# Altium schematic sheet ESP32 with USBC.SchDoc (part 1 of 3)
size A2; SheetNumber: 1; SheetTotal: 1
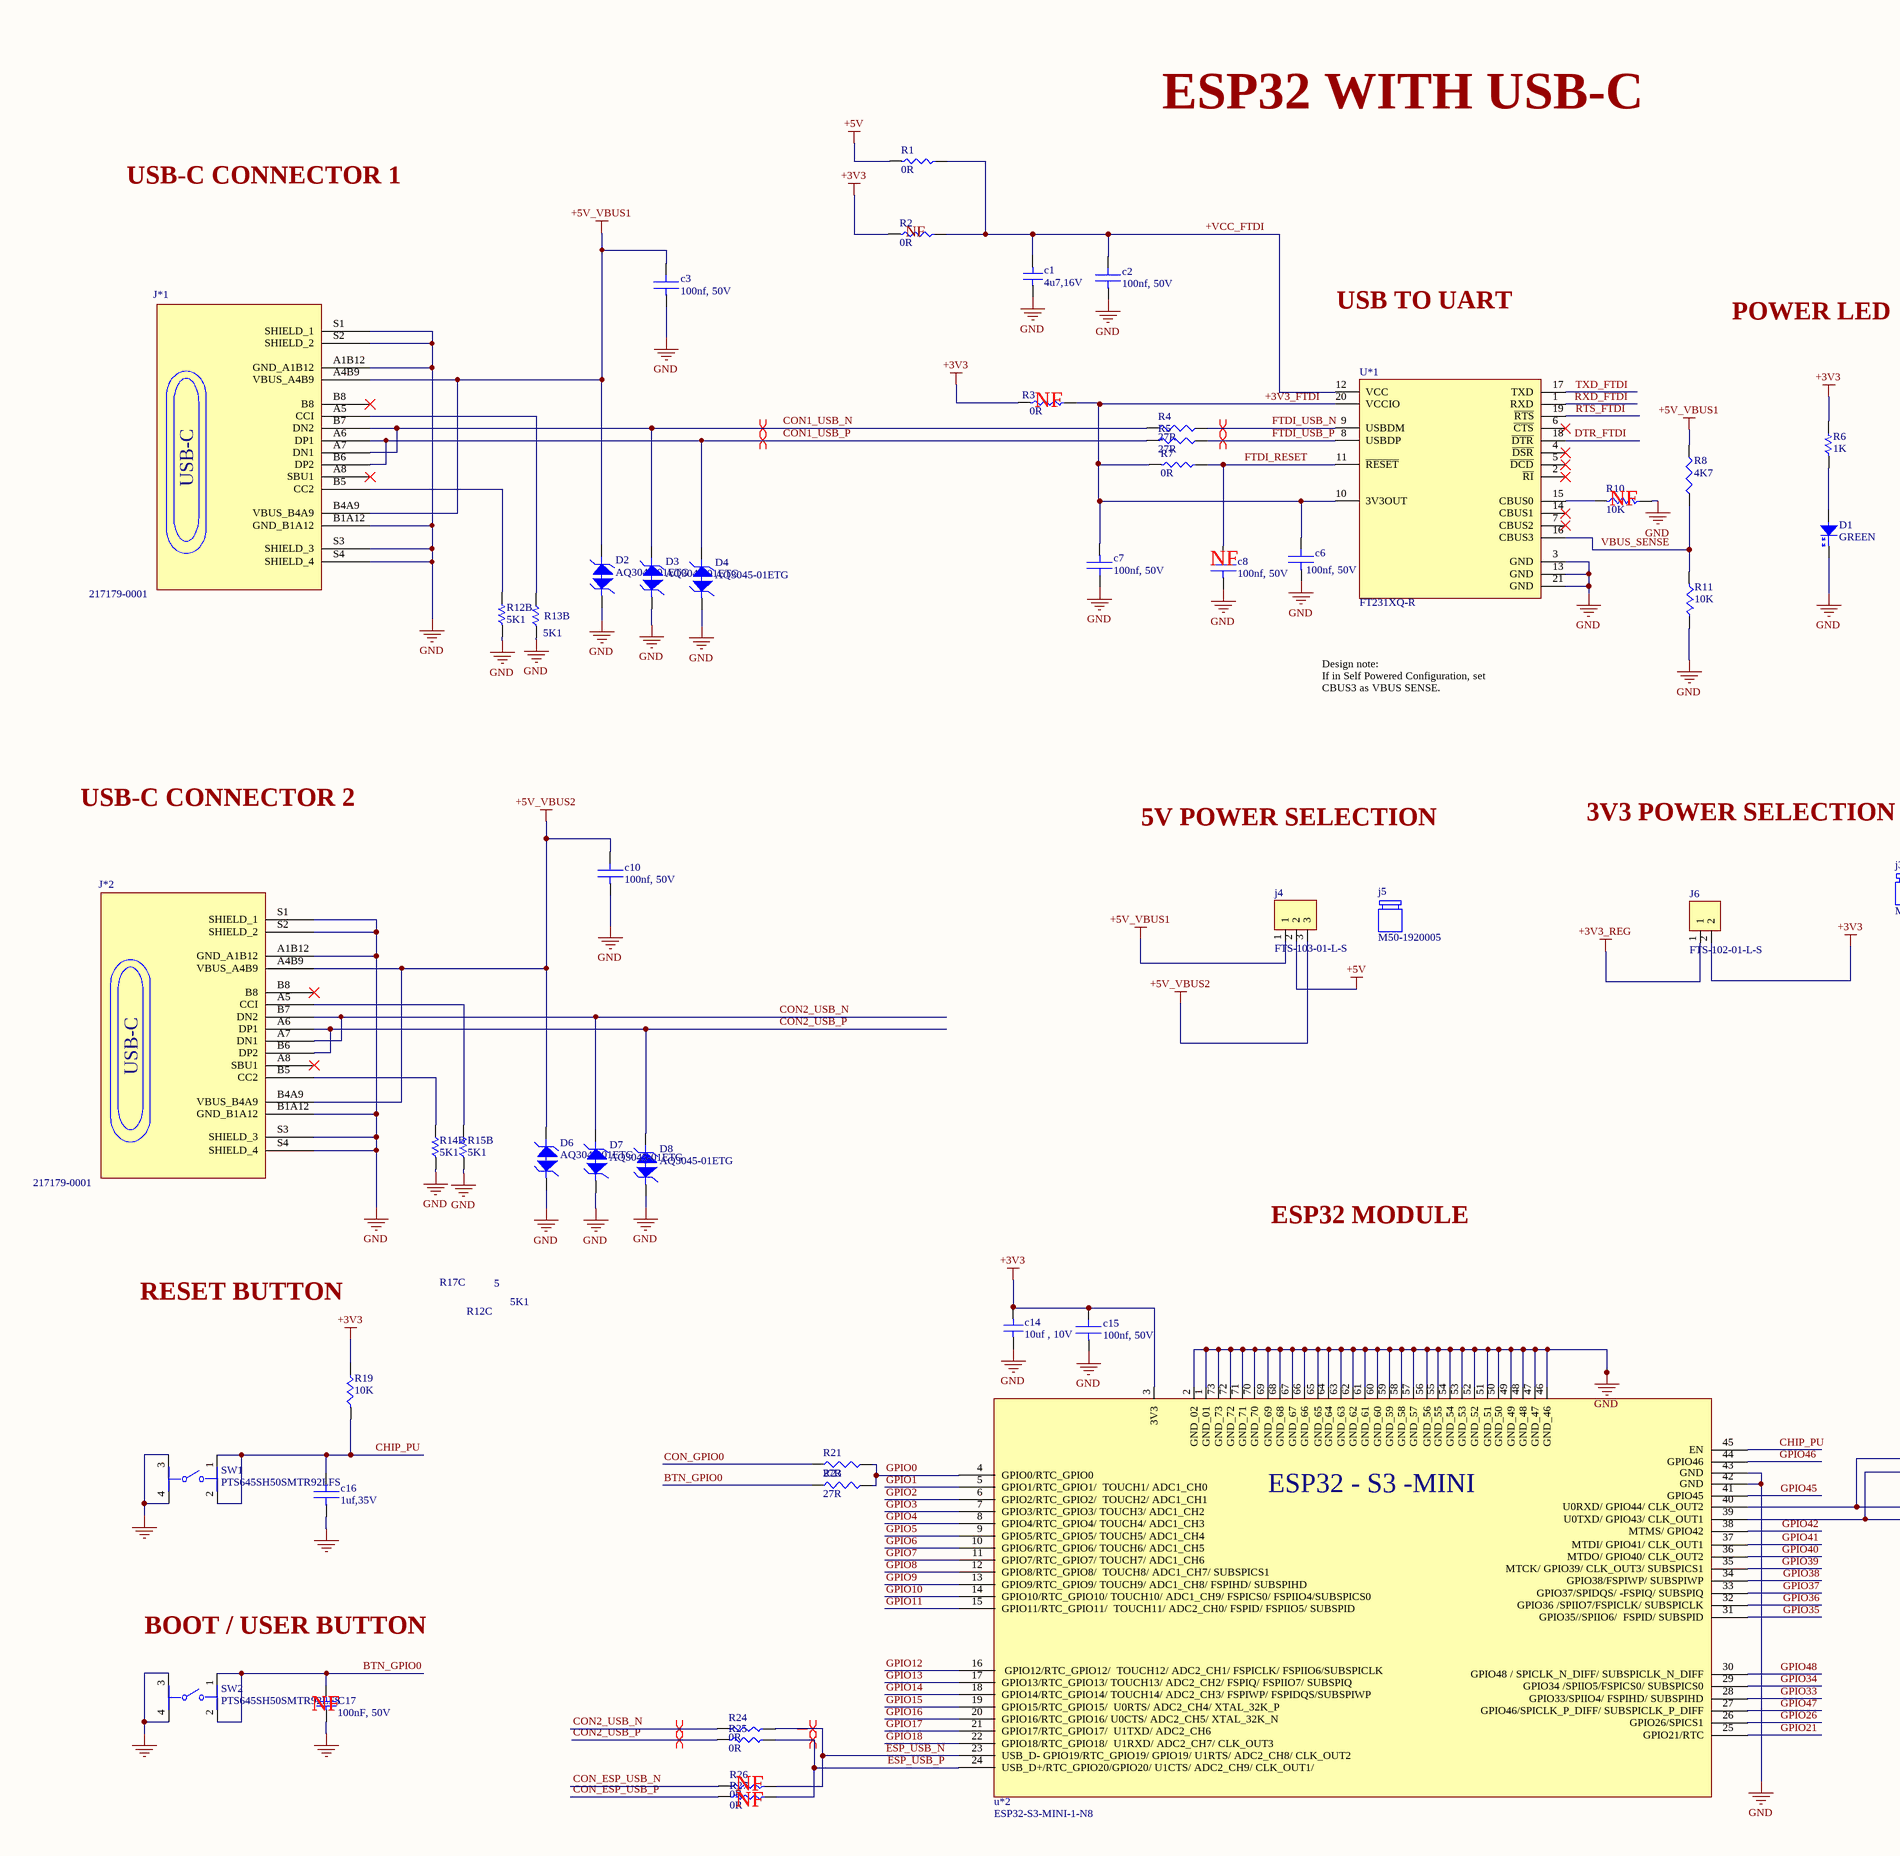
[diagram p0: ESP32 with USBC.SchDoc, left]
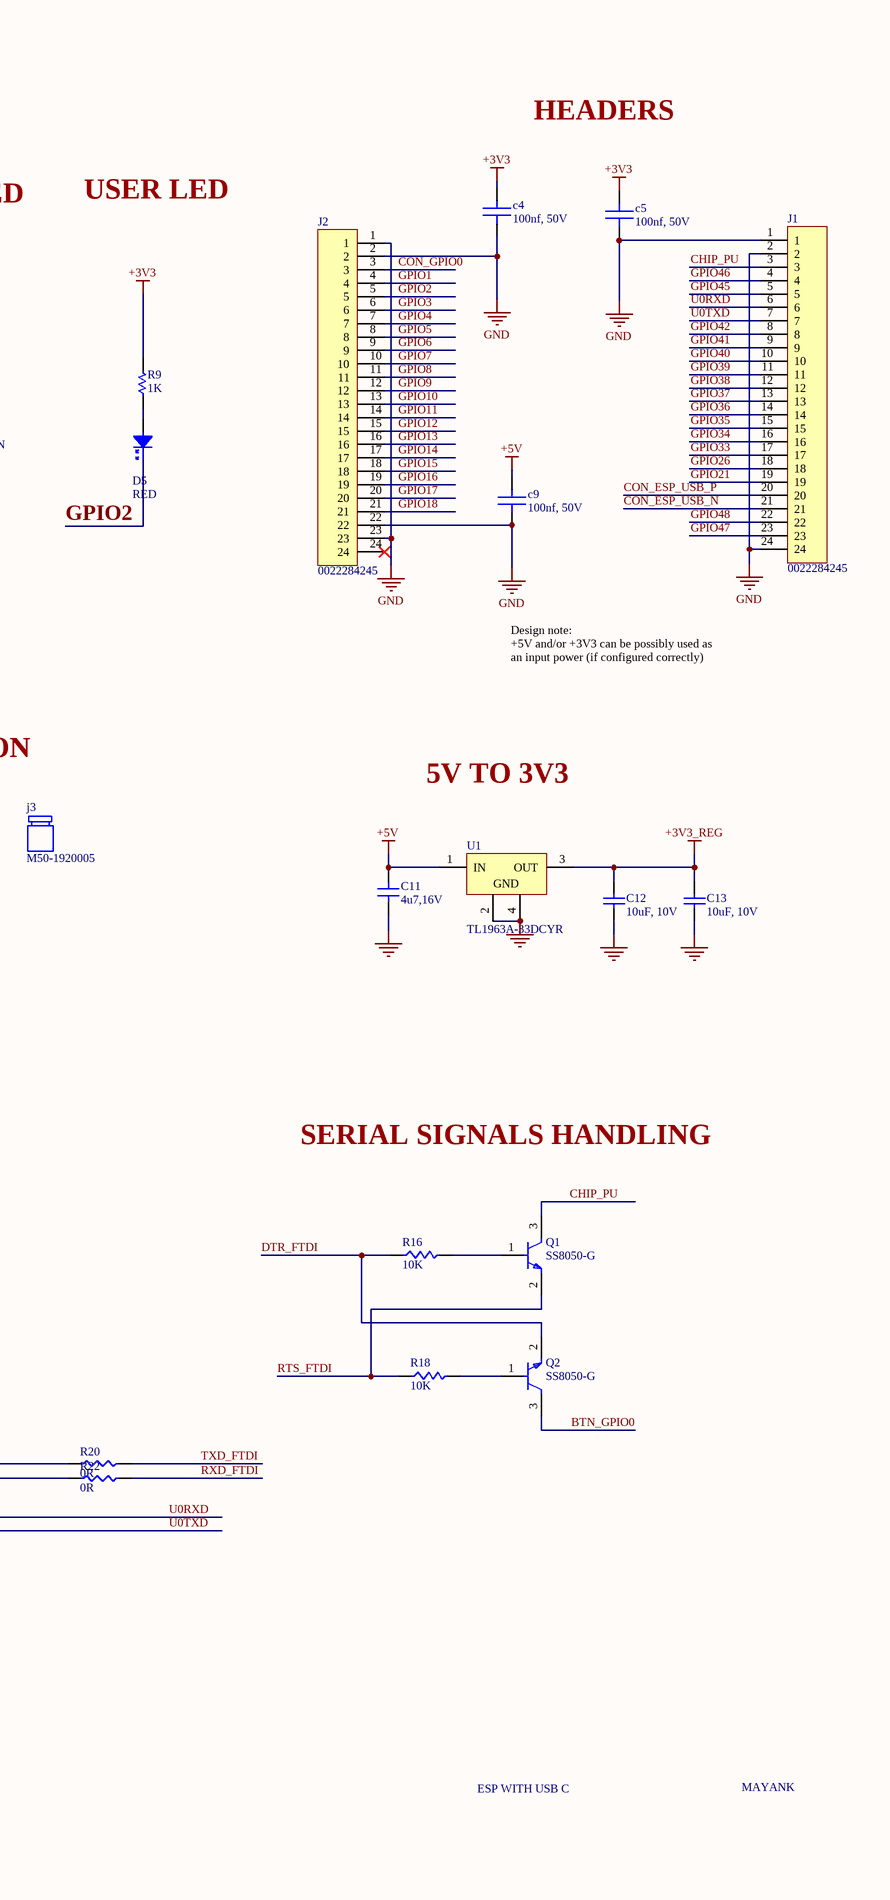
[diagram p1: ESP32 with USBC.SchDoc, right]

## Parts
c1  4u7,16V  [CAPC1005X80N]
c2  100nf, 50V  [CAPC1005X80N]
c3  100nf, 50V  [CAPC1005X80N]
c4  100nf, 50V  [CAPC1005X80N]
c5  100nf, 50V  [CAPC1005X80N]
c6  100nf, 50V  [CAPC1005X80N]
c7  100nf, 50V  [CAPC1005X80N]
c8  100nf, 50V  [CAPC1005X80N]
c9  100nf, 50V  [CAPC1005X80N]
c10  100nf, 50V  [CAPC1005X80N]
C11  4u7,16V  [CAPC1005X80N]
C12  10uF, 10V  [CAPC1005X80N]
C13  10uF, 10V  [CAPC1005X80N]
c14  10uf , 10V  [CAPC1005X80N]
c15  100nf, 50V  [CAPC1005X80N]
c16  1uf,35V  [CAPC1005X80N]
C17  100nF, 50V  [CAPC1005X80N]
D1  GREEN  [LED0402G]
D2  AQ3045-01ETG  [SOD882]
D3  AQ3045-01ETG  [SOD882]
D4  AQ3045-01ETG  [SOD882]
D5  RED  [LED0402R]
D6  AQ3045-01ETG  [SOD882]
D7  AQ3045-01ETG  [SOD882]
D8  AQ3045-01ETG  [SOD882]
J1  0022284245  [HDR_1X24_2.54MM]
J2  0022284245  [HDR_1X24_2.54MM]
j3  M50-1920005  (mechanical)
j4  FTS-103-01-L-S  [HDR_1X3_1.27]
j5  M50-1920005  (mechanical)
J6  FTS-102-01-L-S  [HDR_1X3_1.27MM]
J*1  217179-0001  [FP-2171790001-MFG]
J*2  217179-0001  [FP-2171790001-MFG]
Q1  SS8050-G  [FP-SS8050-G-IPC_A]
Q2  SS8050-G  [FP-SS8050-G-IPC_A]
R1  0R  [RESC1005X37N]
R2  0R  [RESC1005X37N]
R3  0R  [RESC1005X37N]
R4  27R  [RESC1005X37N]
R5  27R  [RESC1005X37N]
R6  1K  [RESC1005X37N]
R7  0R  [RESC1005X37N]
R8  4K7  [RESC1005X37N]
R9  1K  [RESC1005X37N]
R10  10K  [RESC1005X37N]
R11  10K  [RESC1005X37N]
R12  5K1  [RESC1005X37N]  (parts B,C of 3)
R13  5K1  [RESC1005X37N]  (part B of 3)
R14  5K1  [RESC1005X37N]  (part B of 3)
R15  5K1  [RESC1005X37N]  (part B of 3)
R16  10K  [RESC1005X37N]
R17  5  [RESC1005X37N]  (part C of 3)
R18  10K  [RESC1005X37N]
R19  10K  [RESC1005X37N]
R20  0R  [RESC1005X37N]
R21  27R  [RESC1005X37N]
R22  0R  [RESC1005X37N]
R23  27R  [RESC1005X37N]
R24  0R  [RESC1005X37N]
R25  0R  [RESC1005X37N]
R26  0R  [RESC1005X37N]
R27  0R  [RESC1005X37N]
SW1  PTS645SH50SMTR92LFS  [FP-PTS645SH50SMTR92LFS-MFG]
SW2  PTS645SH50SMTR92LFS  [FP-PTS645SH50SMTR92LFS-MFG]
U1  TL1963A-33DCYR  [DCY0004A_L]
U*1  FT231XQ-R  [FP-QFN-20-IPC_B]
u*2  ESP32-S3-MINI-1-N8  [XCVR_ESP32-S3-MINI-1-N8]

## Nets
+3V3: c4.2 c5.2 c14.2 c15.2 J6.2 R2.1 R3.1 R6.2 R9.2 R19.2 u*2.3(3V3)
+3V3_REG: C12.2 C13.2 J6.1 U1.3(OUT)
+5V: c9.2 C11.2 j4.2 R1.1 U1.1(IN)
+5V_VBUS1: c3.2 D2.2 j4.1 J*1.A4B9(VBUS_A4B9) J*1.B4A9(VBUS_B4A9) R8.2
+5V_VBUS2: c10.2 D6.2 j4.3 J*2.A4B9(VBUS_A4B9) J*2.B4A9(VBUS_B4A9)
GND: c1.1 c2.1 c3.1 c4.1 c5.1 c6.1 c7.2 c8.1 c9.1 c10.1 C11.1 C12.1 C13.1 c14.1 c15.1 c16.1 C17.1 D1.1 D2.1 D3.1 D4.1 D6.1 D7.1 D8.1 J1.1 J1.2 J1.24 J2.1 J2.2 J2.22 J2.23 J*1.A1B12(GND_A1B12) J*1.B1A12(GND_B1A12) J*1.S1(SHIELD_1) J*1.S2(SHIELD_2) J*1.S3(SHIELD_3) J*1.S4(SHIELD_4) J*2.A1B12(GND_A1B12) J*2.B1A12(GND_B1A12) J*2.S1(SHIELD_1) J*2.S2(SHIELD_2) J*2.S3(SHIELD_3) J*2.S4(SHIELD_4) R10.2 R11.2 R12.1 R13.1 R14.1 R15.1 SW1.3 SW1.4 SW2.3 SW2.4 U1.2(GND) U1.4(GND) U*1.3(GND) U*1.13(GND) U*1.21(GND) u*2.1(GND_01) u*2.2(GND_02) u*2.42(GND) u*2.43(GND) u*2.46(GND_46) u*2.47(GND_47) u*2.48(GND_48) u*2.49(GND_49) u*2.50(GND_50) u*2.51(GND_51) u*2.52(GND_52) u*2.53(GND_53) u*2.54(GND_54) u*2.55(GND_55) u*2.56(GND_56) u*2.57(GND_57) u*2.58(GND_58) u*2.59(GND_59) u*2.60(GND_60) u*2.61(GND_61) u*2.62(GND_62) u*2.63(GND_63) u*2.64(GND_64) u*2.65(GND_65) u*2.66(GND_66) u*2.67(GND_67) u*2.68(GND_68) u*2.69(GND_69) u*2.70(GND_70) u*2.71(GND_71) u*2.72(GND_72) u*2.73(GND_73)
+3V3_FTDI: c6.2 c7.1 R3.2 R7.1 U*1.10(3V3OUT) U*1.20(VCCIO)
+VCC_FTDI: c1.2 c2.2 R1.2 R2.2 U*1.12(VCC)
BTN_GPIO0: C17.2 Q2.3(C) R23.1 SW2.1 SW2.2
CHIP_PU: c16.2 J1.3 Q1.3(C) R19.1 SW1.1 SW1.2 u*2.45(EN)
CON1_USB_N: D3.2 J*1.A7(DN1) J*1.B7(DN2) R4.1
CON1_USB_P: D4.2 J*1.A6(DP1) J*1.B6(DP2) R5.1
CON2_USB_N: D7.2 J*2.A7(DN1) J*2.B7(DN2) R24.1
CON2_USB_P: D8.2 J*2.A6(DP1) J*2.B6(DP2) R25.1
CON_ESP_USB_N: J1.21 R26.1
CON_ESP_USB_P: J1.20 R27.1
CON_GPIO0: J2.3 R21.1
DTR_FTDI: Q2.2(E) R16.1 U*1.18(~{DTR})
ESP_USB_N: R24.2 R26.2 u*2.23(USB_D-_GPIO19/RTC_GPIO19/_GPIO19/_U1RTS/_ADC2_CH8/_CLK_OUT2)
ESP_USB_P: R25.2 R27.2 u*2.24(USB_D+/RTC_GPIO20/GPIO20/_U1CTS/_ADC2_CH9/_CLK_OUT1/)
FTDI_RESET: c8.2 R7.2 U*1.11(~{RESET})
FTDI_USB_N: R4.2 U*1.9(USBDM)
FTDI_USB_P: R5.2 U*1.8(USBDP)
GPIO0: R21.2 R23.2 u*2.4(GPIO0/RTC_GPIO0)
GPIO1: J2.4 u*2.5(GPIO1/RTC_GPIO1/__TOUCH1/_ADC1_CH0)
GPIO2: D5.1 J2.5 u*2.6(GPIO2/RTC_GPIO2/__TOUCH2/_ADC1_CH1)
GPIO3: J2.6 u*2.7(GPIO3/RTC_GPIO3/_TOUCH3/_ADC1_CH2)
GPIO4: J2.7 u*2.8(GPIO4/RTC_GPIO4/_TOUCH4/_ADC1_CH3)
GPIO5: J2.8 u*2.9(GPIO5/RTC_GPIO5/_TOUCH5/_ADC1_CH4)
GPIO6: J2.9 u*2.10(GPIO6/RTC_GPIO6/_TOUCH6/_ADC1_CH5)
GPIO7: J2.10 u*2.11(GPIO7/RTC_GPIO7/_TOUCH7/_ADC1_CH6)
GPIO8: J2.11 u*2.12(GPIO8/RTC_GPIO8/__TOUCH8/_ADC1_CH7/_SUBSPICS1)
GPIO9: J2.12 u*2.13(GPIO9/RTC_GPIO9/_TOUCH9/_ADC1_CH8/_FSPIHD/_SUBSPIHD)
GPIO10: J2.13 u*2.14(GPIO10/RTC_GPIO10/_TOUCH10/_ADC1_CH9/_FSPICS0/_FSPIIO4/SUBSPICS0)
GPIO11: J2.14 u*2.15(GPIO11/RTC_GPIO11/__TOUCH11/_ADC2_CH0/_FSPID/_FSPIIO5/_SUBSPID)
GPIO12: J2.15 u*2.16(GPIO12/RTC_GPIO12/__TOUCH12/_ADC2_CH1/_FSPICLK/_FSPIIO6/SUBSPICLK)
GPIO13: J2.16 u*2.17(GPIO13/RTC_GPIO13/_TOUCH13/_ADC2_CH2/_FSPIQ/_FSPIIO7/_SUBSPIQ)
GPIO14: J2.17 u*2.18(GPIO14/RTC_GPIO14/_TOUCH14/_ADC2_CH3/_FSPIWP/_FSPIDQS/SUBSPIWP)
GPIO15: J2.18 u*2.19(GPIO15/RTC_GPIO15/__U0RTS/_ADC2_CH4/_XTAL_32K_P)
GPIO16: J2.19 u*2.20(GPIO16/RTC_GPIO16/_U0CTS/_ADC2_CH5/_XTAL_32K_N)
GPIO17: J2.20 u*2.21(GPIO17/RTC_GPIO17/__U1TXD/_ADC2_CH6)
GPIO18: J2.21 u*2.22(GPIO18/RTC_GPIO18/__U1RXD/_ADC2_CH7/_CLK_OUT3)
GPIO21: J1.19 u*2.25(GPIO21/RTC)
GPIO26: J1.18 u*2.26(GPIO26/SPICS1)
GPIO33: J1.17 u*2.28(GPIO33/SPIIO4/_FSPIHD/_SUBSPIHD)
GPIO34: J1.16 u*2.29(GPIO34_/SPIIO5/FSPICS0/_SUBSPICS0)
GPIO35: J1.15 u*2.31(GPIO35//SPIIO6/__FSPID/_SUBSPID)
GPIO36: J1.14 u*2.32(GPIO36_/SPIIO7/FSPICLK/_SUBSPICLK)
GPIO37: J1.13 u*2.33(GPIO37/SPIDQS/_-FSPIQ/_SUBSPIQ)
GPIO38: J1.12 u*2.34(GPIO38/FSPIWP/_SUBSPIWP)
GPIO39: J1.11 u*2.35(MTCK/_GPIO39/_CLK_OUT3/_SUBSPICS1)
GPIO40: J1.10 u*2.36(MTDO/_GPIO40/_CLK_OUT2)
GPIO41: J1.9 u*2.37(MTDI/_GPIO41/_CLK_OUT1)
GPIO42: J1.8 u*2.38(MTMS/_GPIO42)
GPIO45: J1.5 u*2.41(GPIO45)
GPIO46: J1.4 u*2.44(GPIO46)
GPIO47: J1.23 u*2.27(GPIO46/SPICLK_P_DIFF/_SUBSPICLK_P_DIFF)
GPIO48: J1.22 u*2.30(GPIO48_/_SPICLK_N_DIFF/_SUBSPICLK_N_DIFF)
RTS_FTDI: Q1.2(E) R18.1 U*1.19(~{RTS})
RXD_FTDI: R22.2 U*1.1(RXD)
TXD_FTDI: R20.2 U*1.17(TXD)
U0RXD: J1.6 R20.1 u*2.40(U0RXD/_GPIO44/_CLK_OUT2)
U0TXD: J1.7 R22.1 u*2.39(U0TXD/_GPIO43/_CLK_OUT1)
VBUS_SENSE: R8.1 R11.1 U*1.16(CBUS3)
NetD1_2: D1.2 R6.1
NetD5_2: D5.2 R9.1
NetJ*1_A5: J*1.A5(CCI) R13.2
NetJ*1_B5: J*1.B5(CC2) R12.2
NetJ*2_A5: J*2.A5(CCI) R15.2
NetJ*2_B5: J*2.B5(CC2) R14.2
NetQ1_1: Q1.1(B) R16.2
NetQ2_1: Q2.1(B) R18.2
NetR10_1: R10.1 U*1.15(CBUS0)

Not connected (* = marked no-connect by the designer): J2 24*; J*1 A8(SBU1)* B8*; J*2 A8(SBU1)* B8*; U*1 2(~{RI})* 4(~{DSR})* 5(~{DCD})* 6(~{CTS})* 7(CBUS2)* 14(CBUS1)*

## Layout directives
differential pair: CON1_USB_N, CON1_USB_P
differential pair; differential pair class DIFF90: CON2_USB_N, CON2_USB_P, ESP_USB_N, ESP_USB_P, FTDI_USB_N, FTDI_USB_P

## Notes on the sheet
- ESP32 WITH USB-C
- USB-C CONNECTOR 1
- HEADERS
- USB TO UART
- POWER LED
- USER LED
- (near R3) NF
- (near c8) NF
- (near R10) NF
- Design note:
  If in Self Powered Configuration, set CBUS3 as VBUS SENSE.
- Design note:
  +5V and/or +3V3 can be possibly used as an input power (if configured correctly)
- USB-C CONNECTOR 2
- 5V POWER SELECTION
- 3V3 POWER SELECTION
- 5V TO 3V3
- SERIAL SIGNALS HANDLING
- ESP32 MODULE
- RESET BUTTON
- BOOT / USER BUTTON
- (near C17) NF
- ESP WITH USB C
- MAYANK
- NF
- Labels drawn without touching a wire or pin: NF
- (in symbol 217179-0001) USB-C
- (in symbol ESP32-S3-MINI-1-N8) ESP32 - S3 -MINI